# Altium schematic sheet Walrus Coversheet.SchDoc: Cover Sheet
size B; PageSetup: Record=PageOptions|CenterHorizontal=True|CenterVertical=True|PrintScale=1.05|XCorrection=1.00|YCorrection=1.00|PrintKind=2|BorderSize=5000000|LeftOffset=0|BottomOffset=0|Orientation=2|PaperLength=1000|PaperWidth=1000|Scale=100|PaperSource=7|PrintQuality=-4|MediaType=1|DitherType=10|PaperKind=Letter|PrintScaleMode=1; Organization: Morewood Design Labs, Inc.; Address1: 5001 Baum Blvd.; Address2: Suite 675; Address3: Pittsburgh, PA 15213; Address4: 412-687-1110; SheetNumber: 1; SheetTotal: 4; Client: Test; Project: {ENTER PROJECT}; MdlPcbNumber: Test; ClientPcbNumber: Test; ClientPcbaNumber: Test; ClientPcbaRev: Test; ClientPcbRev: Test; ProjectName: Walrus
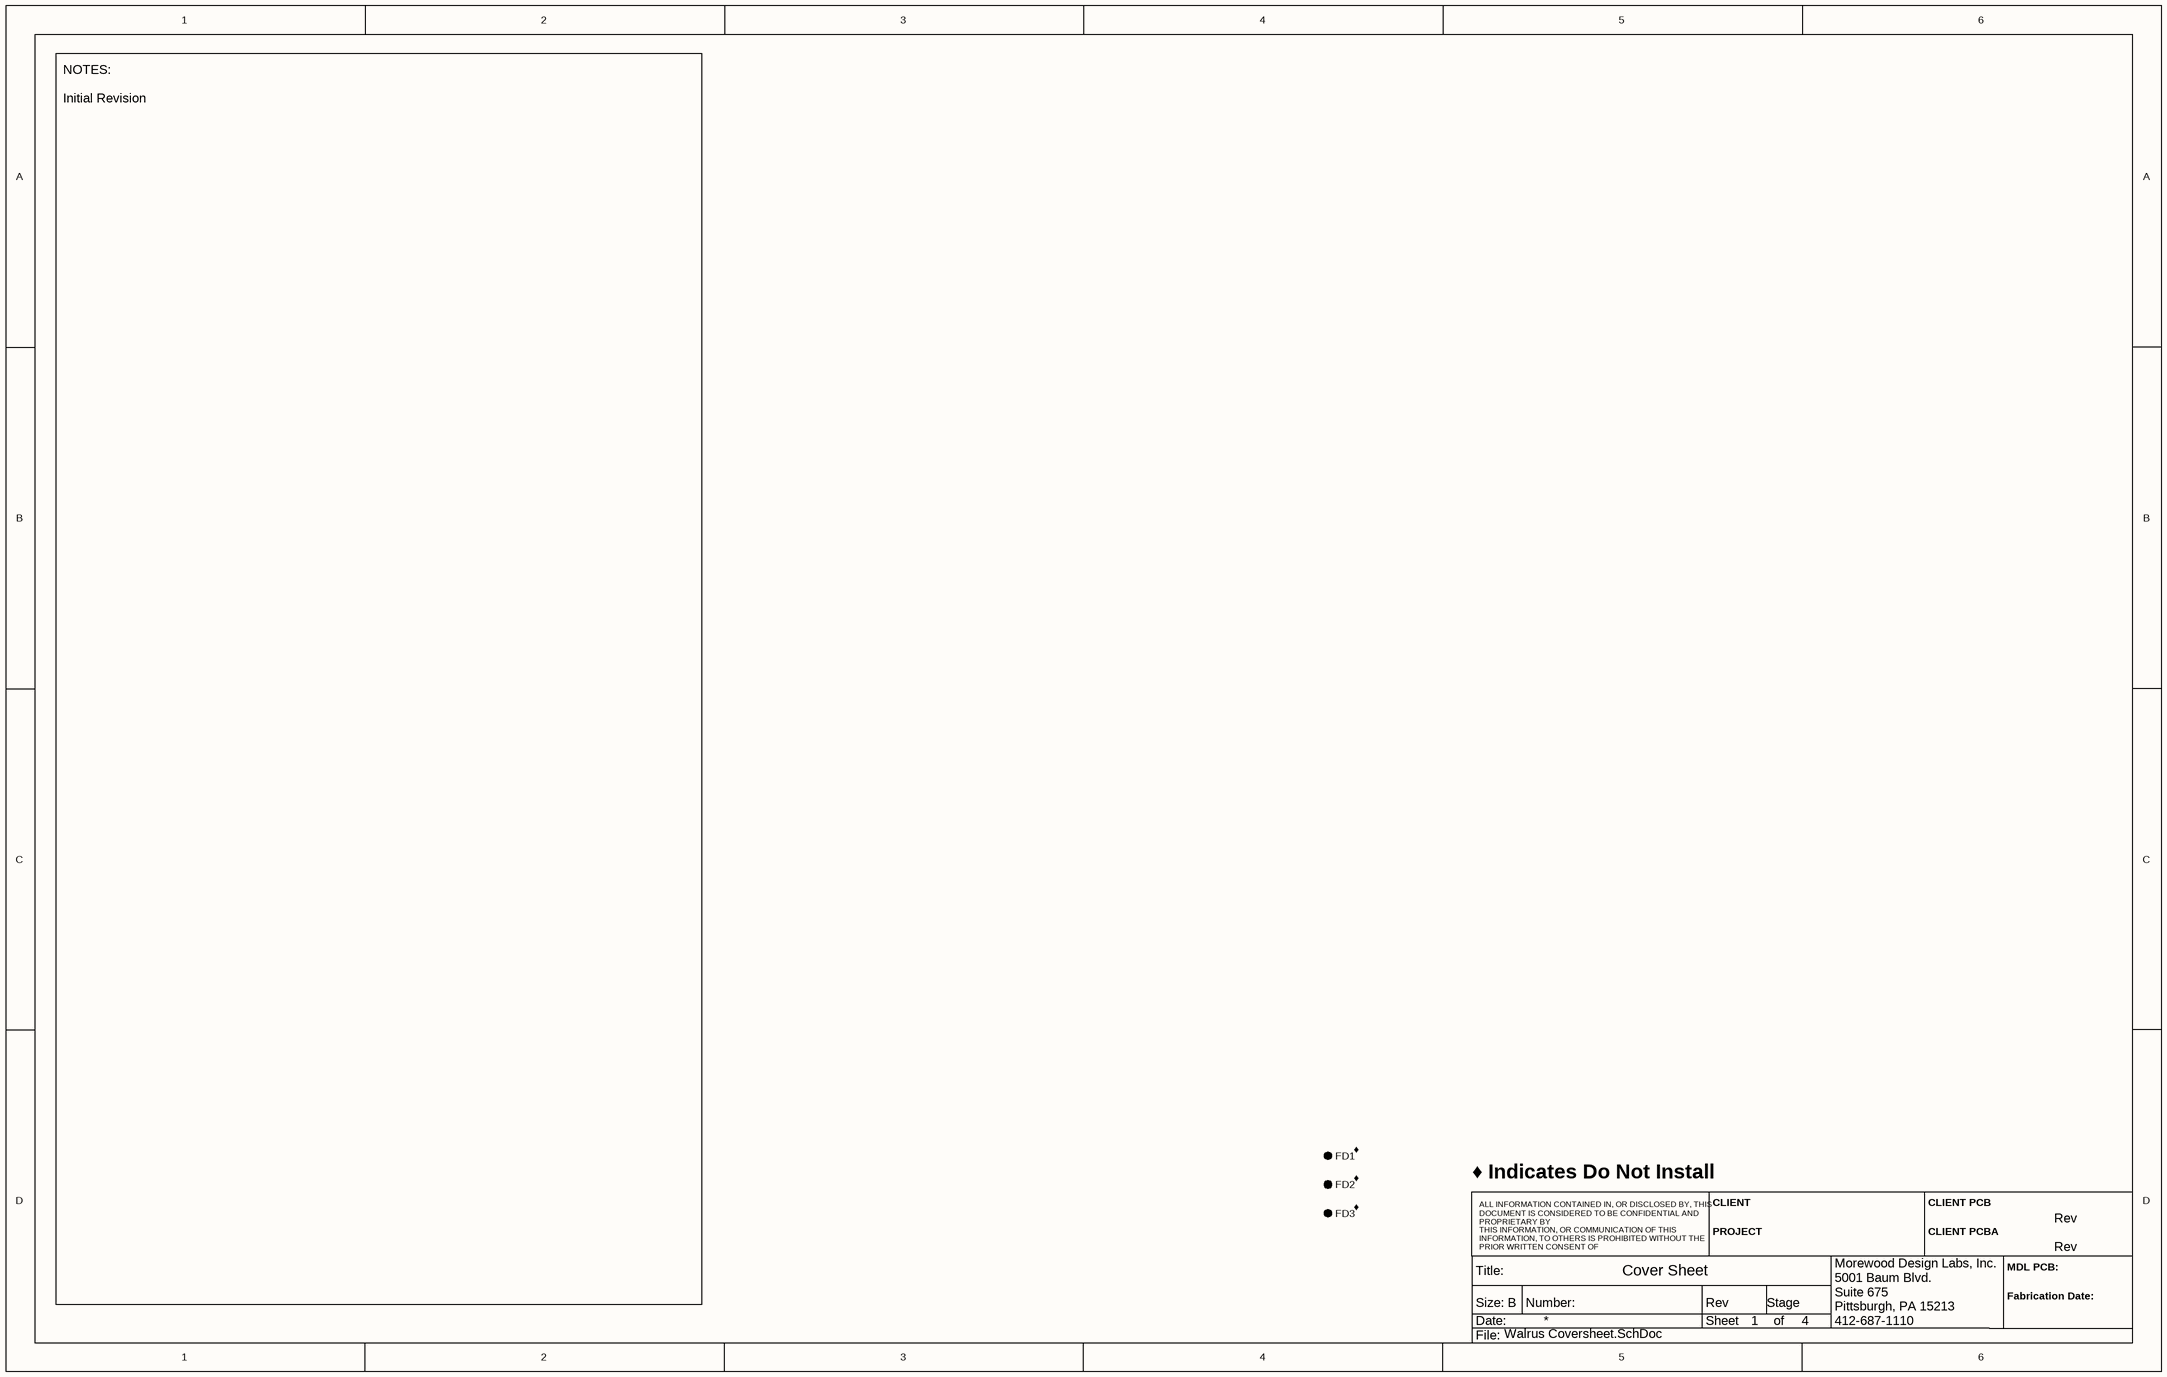
[diagram p0: Walrus Coversheet.SchDoc]

## Parts
FD1  DNI: ♦  [FD75]  (hidden comment: Fiducial, Single Side, 0.75mm Land)
FD2  DNI: ♦  [FD75]  (hidden comment: Fiducial, Single Side, 0.75mm Land)
FD3  DNI: ♦  [FD75]  (hidden comment: Fiducial, Single Side, 0.75mm Land)

## Notes on the sheet
- ♦ Indicates Do Not Install
- NOTES:
  Initial Revision
- ALL INFORMATION CONTAINED IN, OR DISCLOSED BY, THIS DOCUMENT IS CONSIDERED TO BE CONFIDENTIAL AND PROPRIETARY BY
- THIS INFORMATION, OR COMMUNICATION OF THIS INFORMATION, TO OTHERS IS PROHIBITED WITHOUT THE PRIOR WRITTEN CONSENT OF
- CLIENT
- PROJECT
- CLIENT PCB
- CLIENT PCBA
- MDL PCB:
- Rev
- Title:
- Size:
- Date:
- B
- Number:
- Sheet
- Stage
- of
- Fabrication Date:
- File:

## Library data of the parts
FD1-FD3 = FD_000001: Fiducial, PCB Printed Copper Feature; MDLPartNumber: FD_000001; CreationDate: 9/3/2010; Creator: R. Casciola; LeadFree: True; RoHS: True